# EAGLE design l293d (EAGLE 8.2.1)
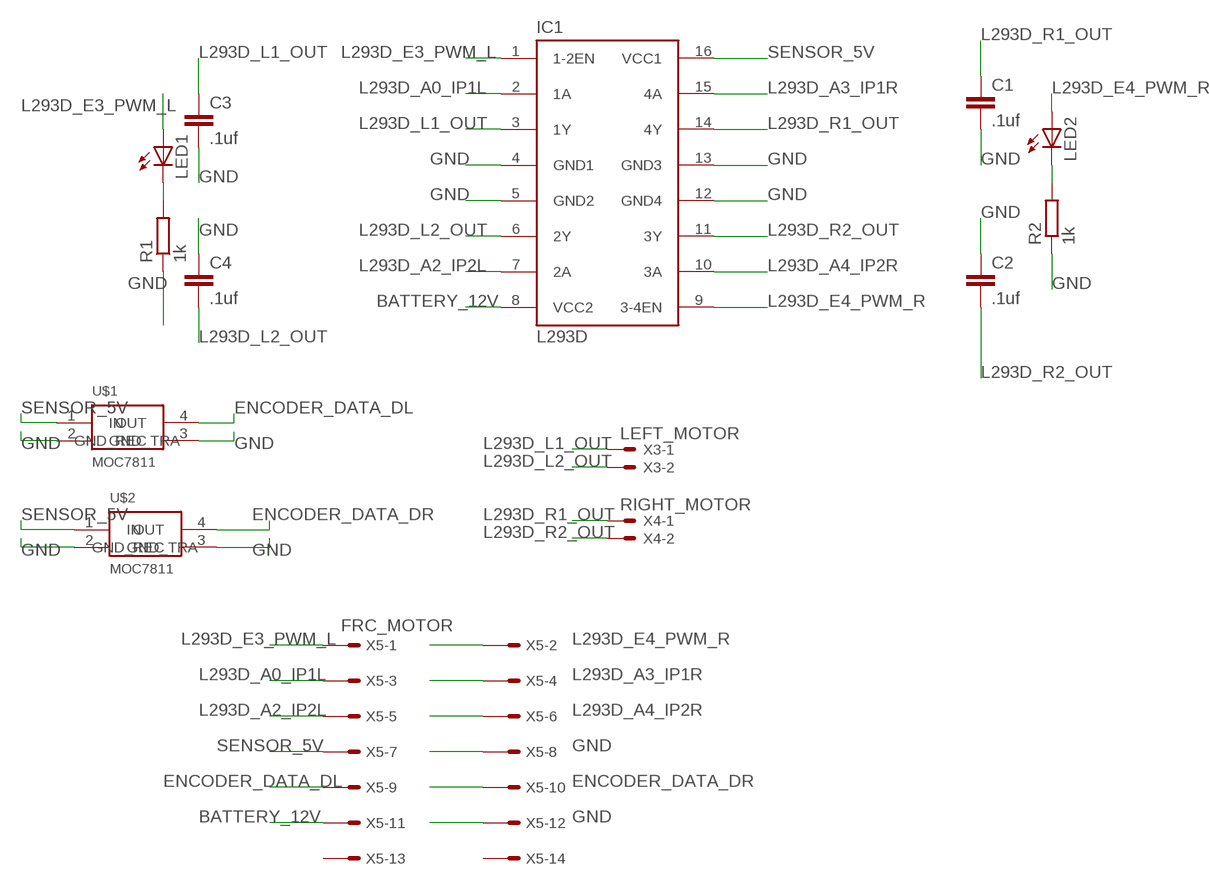
[diagram p0: schematic, sheet 1]

## Parts
C1  .1uf  C-EUC1206  [C1206]
C2  .1uf  C-EUC1206  [C1206]
C3  .1uf  C-EUC1206  [C1206]
C4  .1uf  C-EUC1206  [C1206]
IC1  L293D  [DIL16]
LED1  LEDSMT1206  [1206]
LED2  LEDSMT1206  [1206]
R1  1k  R-EU_M1206  [M1206]
R2  1k  R-EU_M1206  [M1206]
U$1  MOC7811  [THROUGH_HOLE_NORMAL]
U$2  MOC7811  [THROUGH_HOLE_NORMAL]
X3  LEFT_MOTOR  22-23-2021  [22-23-2021]
X4  RIGHT_MOTOR  22-23-2021  [22-23-2021]
X5  FRC_MOTOR  057-014-1  [057-014-1]

## Nets
BATTERY_12V: IC1.8(VCC2) X5.11
ENCODER_DATA_DL: U$1.4(OUT) X5.9
ENCODER_DATA_DR: U$2.4(OUT) X5.10
GND: C1.2 C2.1 C3.2 C4.1 IC1.4(GND1) IC1.5(GND2) IC1.12(GND4) IC1.13(GND3) R1.1 R2.1 U$1.2(GND_TRA) U$1.3(GND_REC) U$2.2(GND_TRA) U$2.3(GND_REC) X5.8 X5.12
L293D_A0_IP1L: IC1.2(1A) X5.3
L293D_A2_IP2L: IC1.7(2A) X5.5
L293D_A3_IP1R: IC1.15(4A) X5.4
L293D_A4_IP2R: IC1.10(3A) X5.6
L293D_E3_PWM_L: IC1.1(1-2EN) LED1.A X5.1
L293D_E4_PWM_R: IC1.9(3-4EN) LED2.A X5.2
L293D_L1_OUT: C3.1 IC1.3(1Y) X3.1
L293D_L2_OUT: C4.2 IC1.6(2Y) X3.2
L293D_R1_OUT: C1.1 IC1.14(4Y) X4.1
L293D_R2_OUT: C2.2 IC1.11(3Y) X4.2
N$2: LED1.C R1.2
N$4: LED2.C R2.2
SENSOR_5V: IC1.16(VCC1) U$1.1(IN) U$2.1(IN) X5.7
Unconnected: X5.13 X5.14

## Library data of the parts
C1-C4 = rcl:C-EU: CAPACITOR, European symbol
IC1 = st-microelectronics:L293D: PUSH-PULL 4 CHANNEL DRIVER; MPN: L293D; OC_FARNELL: 9589619; OC_NEWARK: 56P8249
LED1 LED2 = led:LED: LED OSRAM: - CHIPLED LG R971, LG N971, LY N971, LG Q971, LY Q971, LO R971, LY R971 LH N974, LH R974 LS Q976, LO Q976, LY Q976 LO Q996 - Hyper CHIPLED LW Q18S LB Q993, LB Q99A, LB R99A - SideLED LS A670, LO A670, LY A670, LG A670, LP A670 LB A673, LV A673, LT A673, LW A673 LH A674 LY A675 LS A676, LA A676, LO A676, LY A676, LW A676 LS A679, LY A679, LG A679 - Hyper Micro SIDELED® LS Y876, LA Y876, LO Y876, LY Y876 LT Y87S - SmartLED LW L88C, LW L88S LB L89C, LB L89S, LG L890 LS L89K, LO L89K, LY L89K LS L896, LA L896, LO L896, LY L896 - TOPLED LS T670, LO T670, LY T670, LG T670, LP T670 LSG T670, LSP T670, LSY T670, LOP T670, LYG T670 LG T671, LOG T671, LSG T671 LB T673, LV T673, LT T673, LW T673 LH T674 LS T676, LA T676, LO T676, LY T676, LB T676, LH T676, LSB T676, LW T676 LB T67C, LV T67C, LT T67C, LS T67K, LO T67K, LY T67K, LW E67C LS E67B, LA E67B, LO E67B, LY E67B, LB E67C, LV E67C, LT E67C LW T67C LS T679, LY T679, LG T679 LS T770, LO T770, LY T770, LG T770, LP T770 LB T773, LV T773, LT T773, LW T773 LH T774 LS E675, LA E675, LY E675, LS T675 LS T776, LA T776, LO T776, LY T776, LB T776 LHGB T686 LT T68C, LB T68C - Hyper Mini TOPLED® LB M676 - Mini TOPLED Santana® LG M470 LS M47K, LO M47K, LY M47K Source: http://www.osram.convergy.de LUXEON: - LUMILED® LXK2-PW12-R00, LXK2-PW12-S00, LXK2-PW14-U00, LXK2-PW14-V00 LXK2-PM12-R00, LXK2-PM12-S00, LXK2-PM14-U00 LXK2-PE12-Q00, LXK2-PE12-R00, LXK2-PE12-S00, LXK2-PE14-T00, LXK2-PE14-U00 LXK2-PB12-K00, LXK2-PB12-L00, LXK2-PB12-M00, LXK2-PB14-N00, LXK2-PB14-P00, LXK2-PB14-Q00 LXK2-PR12-L00, LXK2-PR12-M00, LXK2-PR14-Q00, LXK2-PR14-R00 LXK2-PD12-Q00, LXK2-PD12-R00, LXK2-PD12-S00 LXK2-PH12-R00, LXK2-PH12-S00 LXK2-PL12-P00, LXK2-PL12-Q00, LXK2-PL12-R00 Source: www.luxeon.com KINGBRIGHT: KA-3528ASYC Source: www.kingbright.com
R1 R2 = rcl:R-EU_: RESISTOR, European symbol
U$1 U$2 = Motor encoder MOC7811:MOC7811: MOC7811 is a slotted opto isolator module, with an IR transmitter and a photodiode mounted on it. Performs Non-Contact Object Sensing
X3 X4 = con-molex:22-23-2021: .100" (2.54mm) Center Header - 2 Pin; MF: MOLEX; MPN: 22-23-2021; OC_FARNELL: 1462926; OC_NEWARK: 25C3832
X5 = con-panduit:057-014-: CONNECTOR 10-pin series 057 contact pc board low profile headers; OC_FARNELL: unknown; OC_NEWARK: unknown

## Board
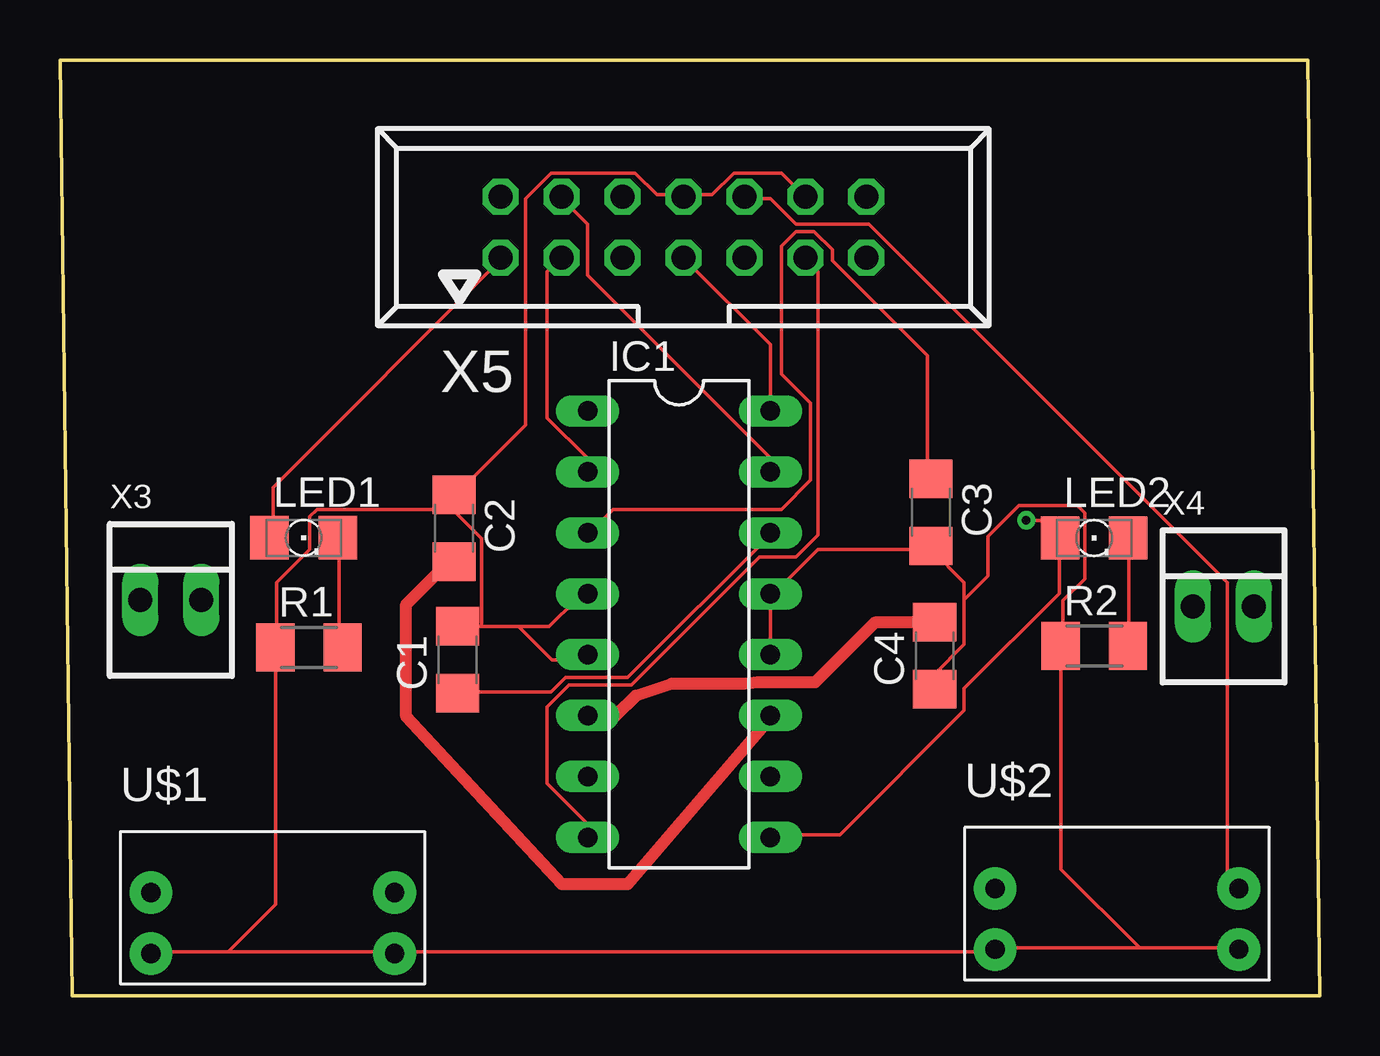
[diagram p1: board, top side]
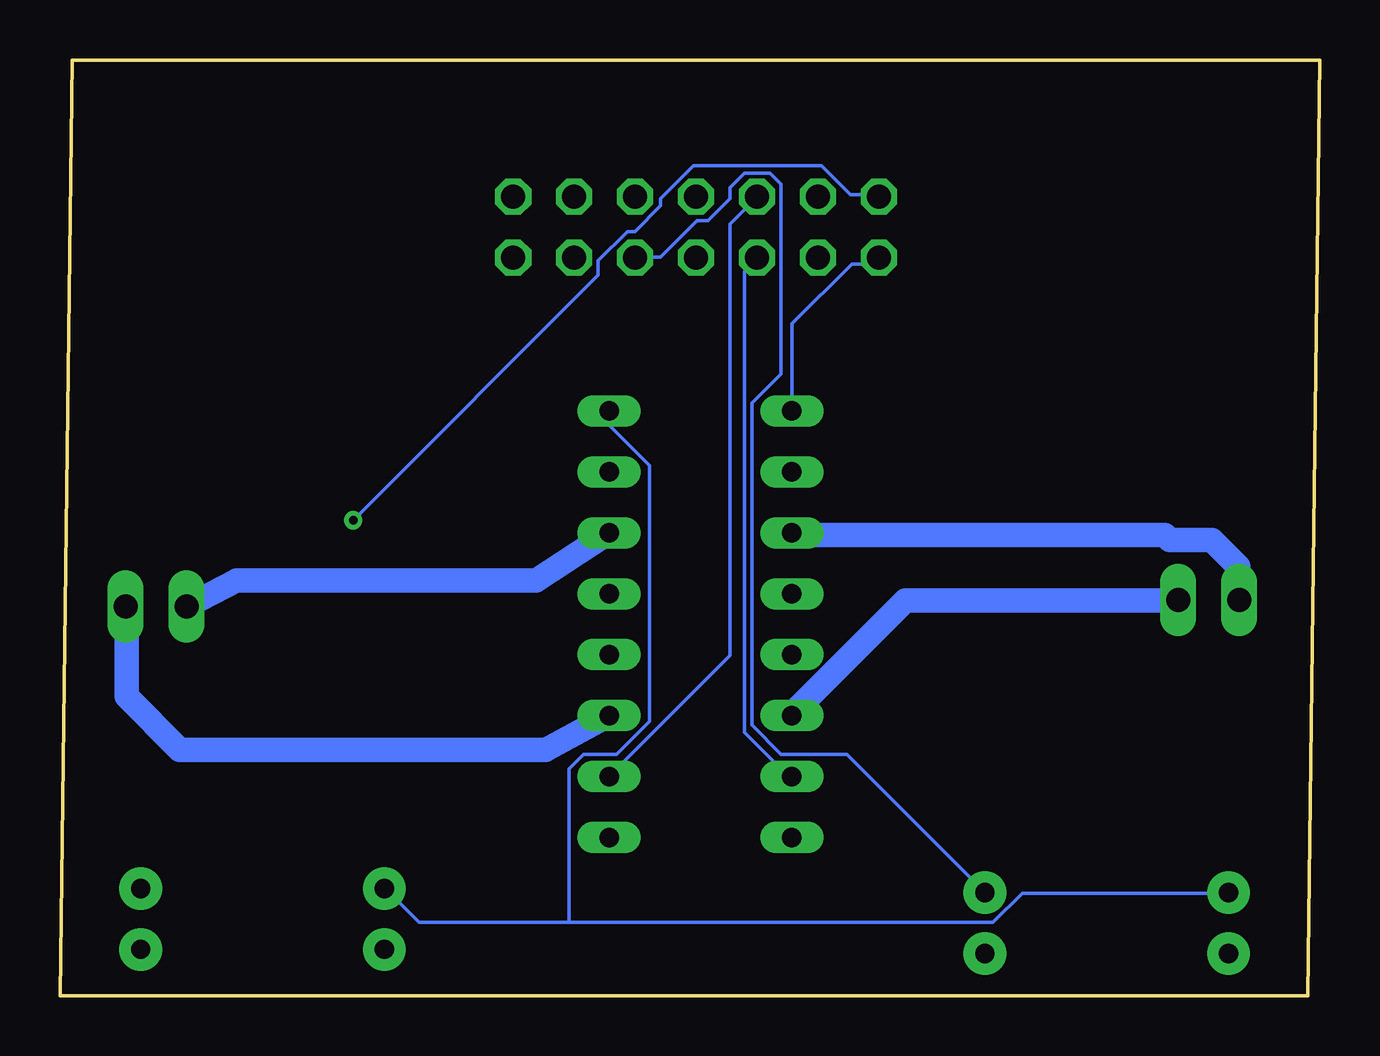
[diagram p2: board, bottom side, seen from below]

Size 52.5 x 39 mm. Coordinates in mm from the lower left corner, seen from the top.
Outline: 0.5,0 52.5,0 52,39 0,39 0.5,0
Copper layers (1*16): Top 0.035mm / dielectric 1.5mm / Bottom 0.035mm
Design rules "default": minimum track width 6mil, minimum drill 0.35mm, track to track 6mil, track to pad 6mil, pad to pad 6mil, via to via 6mil, smd to smd 6mil, copper to edge 40mil, drill to drill 6mil, minimum pad ring 10mil, minimum via ring 8mil, stop-mask expansion 4mil, vias tented up to drill 0mil, thermal gap 10mil

### Footprints (pad centres in the part's own frame; a part is rotated, then mirrored left to right if it is on the bottom)
C1206 = smd 1.6 x 1.8: 1 -1.4,0; 2 1.4,0
DIL16 = drill 0.813 long: 1 -8.89,-3.81; 2 -6.35,-3.81; 3 -3.81,-3.81; 4 -1.27,-3.81; 5 1.27,-3.81; 6 3.81,-3.81; 7 6.35,-3.81; 8 8.89,-3.81; 9 8.89,3.81; 10 6.35,3.81; 11 3.81,3.81; 12 1.27,3.81; 13 -1.27,3.81; 14 -3.81,3.81; 15 -6.35,3.81; 16 -8.89,3.81
1206 = smd 1.6 x 1.803: A -1.422,0; C 1.422,0
M1206 = smd 1.6 x 2: 1 -1.4,0; 2 1.4,0
THROUGH_HOLE_NORMAL = drill 0.8 pad 1.778: 1 -5.08,1.27; 2 -5.08,-1.27; 3 5.08,-1.27; 4 5.08,1.27
22-23-2021 = drill 1 long: 1 -1.27,0; 2 1.27,0
057-014-1 = drill 1 octagon: 1 -7.62,-1.27; 2 -7.62,1.27; 3 -5.08,-1.27; 4 -5.08,1.27; 5 -2.54,-1.27; 6 -2.54,1.27; 7 0,-1.27; 8 0,1.27; 9 2.54,-1.27; 10 2.54,1.27; 11 5.08,-1.27; 12 5.08,1.27; 13 7.62,-1.27; 14 7.62,1.27

### Placement (x,y rotation side)
C1  16.57,14 90 top
C2  16.43,19.48 270 top
C3  36.3,20.14 270 top
C4  36.46,14.17 90 top
IC1  25.8,15.48 270 top
LED1  10.16,19.08 0 top
LED2  43.1,19.07 0 top
R1  10.38,14.52 0 top
R2  43.11,14.57 0 top
U$1  8.87,3.02 0 top
U$2  44.06,3.19 0 top
X3  4.62,16.49 0 top
X4  48.5,16.22 0 top
X5  25.99,32.03 0 top

### Tracks (layer width: path | path; a pad name or v marks a point on that pad's centre or on a via)
BATTERY_12V
  Top 0.152: IC1.8 21.99,6.71 21.99,7.16 20.31,8.84 20.31,12.04 21.23,12.95 23.82,12.95 29.15,18.29 30.68,18.29 31.59,19.2 31.59,30.18 31.13,30.63 X5.11
ENCODER_DATA_DL
  Bottom 0.152: X5.9 28.39,30.79 27.48,30.79 25.95,32.31 25.49,32.31 24.58,33.22 24.58,33.68 23.97,34.29 22.9,34.29 22.45,33.83 22.45,25.91 23.66,24.69 23.66,11.28 22.45,10.06 19.7,10.06 14.06,4.42 U$1.4
ENCODER_DATA_DR
  Top 0.152: X5.10 28.54,33.22 29.61,33.22 30.68,32.16 33.72,32.16 48.66,17.22 48.66,5.03 49.12,4.57 U$2.4
GND
  Top 0.152: 45,1.98 49.12,1.98 U$2.3 | 45,1.98 39.06,1.98 U$2.2 38.91,1.83 14.06,1.83 U$1.3 13.91,1.83 7,1.83 | 37.69,16.5 37.69,14.63 36.47,13.41 36.47,12.8 C4.1 | 37.69,16.5 37.69,17.22 36.31,18.59 C3.2 36.16,18.59 31.59,18.59 29.76,16.76 IC1.13 29.61,16.61 29.61,14.33 IC1.12 | R2.1 41.8,14.63 41.8,16.46 42.72,17.37 42.72,20.12 42.41,20.42 39.97,20.42 38.69,19.14 38.69,17.5 37.69,16.5 | 41.8,14.48 R2.1 | 7,1.83 3.85,1.83 U$1.2 | X5.12 30.98,33.38 30.07,34.29 28.08,34.29 27.17,33.38 26.1,33.38 X5.8 25.95,33.38 24.88,33.38 23.97,34.29 20.46,34.29 19.4,33.22 19.4,23.77 16.5,20.88 C2.1 | 17.57,15.39 16.65,15.39 C1.2 | 21.99,14.33 IC1.5 21.78,14 20.5,14 19.11,15.39 | 16.5,20.27 16.5,20.12 17.57,19.05 17.57,15.39 | 16.5,20.27 16.5,20.73 C2.1 | 16.5,20.27 10.71,20.27 10.41,19.96 10.41,18.59 9.03,17.22 9.03,14.63 R1.1 | 16.5,20.27 C2.1 | 21.99,16.61 IC1.4 21.74,16.5 21.5,16.5 20.39,15.39 19.11,15.39 | 8.88,14.48 R1.1 | 17.57,15.39 19.11,15.39 | R1.1 8.98,3.81 7,1.83 | R2.1 41.71,5.27 45,1.98
L293D_A0_IP1L
  Top 0.152: IC1.2 21.99,21.95 21.99,22.4 20.31,24.08 20.31,30.18 20.77,30.63 X5.3
L293D_A2_IP2L
  Bottom 0.152: IC1.7 22.14,9.14 23.97,10.97 23.97,30.18 23.51,30.63 X5.5
L293D_A3_IP1R
  Top 0.152: IC1.15 29.61,21.95 29.61,22.4 21.99,30.02 21.99,32.16 20.92,33.22 X5.4
L293D_A4_IP2R
  Bottom 0.152: IC1.10 29.61,9.14 24.58,14.17 24.58,32.16 23.51,33.22 X5.6
L293D_E3_PWM_L
  Top 0.152: LED1.A 8.88,19.2 8.88,21.18 18.33,30.63 X5.1
  Bottom 0.152: IC1.1 21.99,24.38 21.99,28.01 19.5,30.5 18.62,30.5 18.48,30.63 X5.1
L293D_E4_PWM_R  (via drill 0.35)
  Top 0.152: LED2.A 41.65,19.05 41.65,16.76 37.69,12.8 37.69,11.89 32.5,6.71 29.76,6.71 IC1.9 | v40.28,19.81 41.04,19.81 41.65,19.2 LED2.A | LED2.A 42.41,18.34
  Bottom 0.152: v40.28,19.81 30.07,30.02 30.07,30.63 28.85,31.85 28.54,31.85 27.48,32.92 27.48,33.22 26.1,34.59 20.77,34.59 19.55,33.38 18.48,33.38 X5.2
L293D_L1_OUT
  Top 0.152: C3.1 36.16,21.64 36.16,26.67 32.2,30.63 32.2,31.09 31.44,31.85 30.68,31.85 30.07,31.24 30.07,25.91 31.29,24.69 31.29,21.49 30.07,20.27 23.05,20.27 22.14,19.36 IC1.3
  Bottom 0.152: 3.85,16.61 3.4,16.61 X3.1 | 21.99,19.2 IC1.3 | 6.44,19.2 6.24,19
  Bottom 1.016: 21.99,19.2 6.44,19.2 | 6.24,19 4.5,19 3.4,17.9 3.4,16.61
L293D_L2_OUT
  Top 0.152: 36.31,15.54 C4.2
  Top 0.508: 36.31,15.54 33.96,15.54 31.48,13.06 29.08,13.06 28.52,13 25.5,13 24,12.5 23.17,11.67 IC1.6
  Bottom 0.152: 5.99,16.46 X3.2 | 21.99,11.73 IC1.6
  Bottom 1.016: 5.99,16.46 14.5,16.46 17.26,16.46 21.99,11.73
L293D_R1_OUT
  Top 0.152: C1.1 16.65,12.65 20.46,12.65 21.07,13.26 23.66,13.26 29.61,19.2 IC1.14
  Bottom 0.152: 29.76,19.2 IC1.14
  Bottom 1.016: 29.76,19.2 32.66,17.31 45.13,17.31 X4.1
L293D_R2_OUT
  Top 0.152: C2.2 16.35,17.98 16.11,17.98 | 29.61,11.58 IC1.11
  Top 0.508: 29.61,11.58 23.66,4.64 20.92,4.64 14.44,11.62 14.44,16.31 16.11,17.98
  Bottom 0.152: 49.92,16.15 49.73,16.15 X4.2
  Bottom 1.016: IC1.11 32.26,10.23 47.5,10.23 49.73,12.46 49.73,16.15
N$2
  Top 0.152: LED1.C 11.62,19.05 11.62,14.78 11.78,14.63 R1.2
N$4
  Top 0.152: LED2.C 44.54,19.05 44.54,14.63 R2.2
SENSOR_5V
  Top 0.152: IC1.16 29.61,24.38 29.61,27.13 26.1,30.63 X5.7
  Bottom 0.152: 31.29,3.05 37.53,3.05 38.91,4.42 U$2.1 | 31.29,3.05 13.61,3.05 12.39,4.27 3.85,4.27 U$1.1 | 31.29,3.05 31.29,9.45 30.68,10.06 29.3,10.06 27.93,11.43 27.93,22.1 29.61,23.77 29.61,24.23 IC1.16